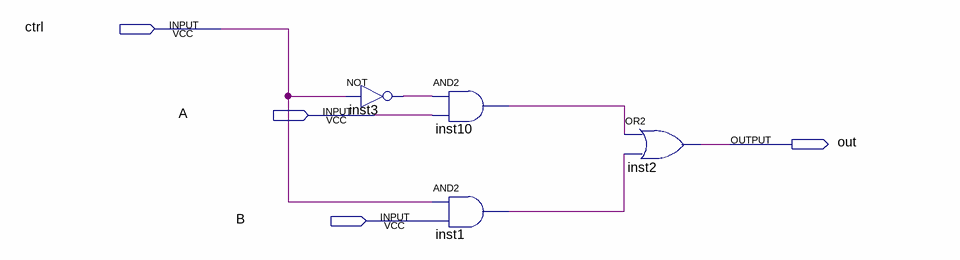
[diagram p0: schematic sheet]
// Quartus schematic 2to1.bdf as structural Verilog: 4 symbols, 4 pins
module \2to1  (
  input  ctrl,
  input  A,
  input  B,
  output out
);

  wire inst1_out, inst3_out, inst10_out;

  not inst3 (inst3_out, ctrl);
  and inst10 (inst10_out, inst3_out, A);
  and inst1 (inst1_out, ctrl, B);
  or inst2 (out, inst10_out, inst1_out);
endmodule
